# Altium schematic sheet CPU - DDR3.SchDoc: DDR3 SDRAM
size Tabloid; Revision: A; ProjectTitle: CDU: CAN Display Unit
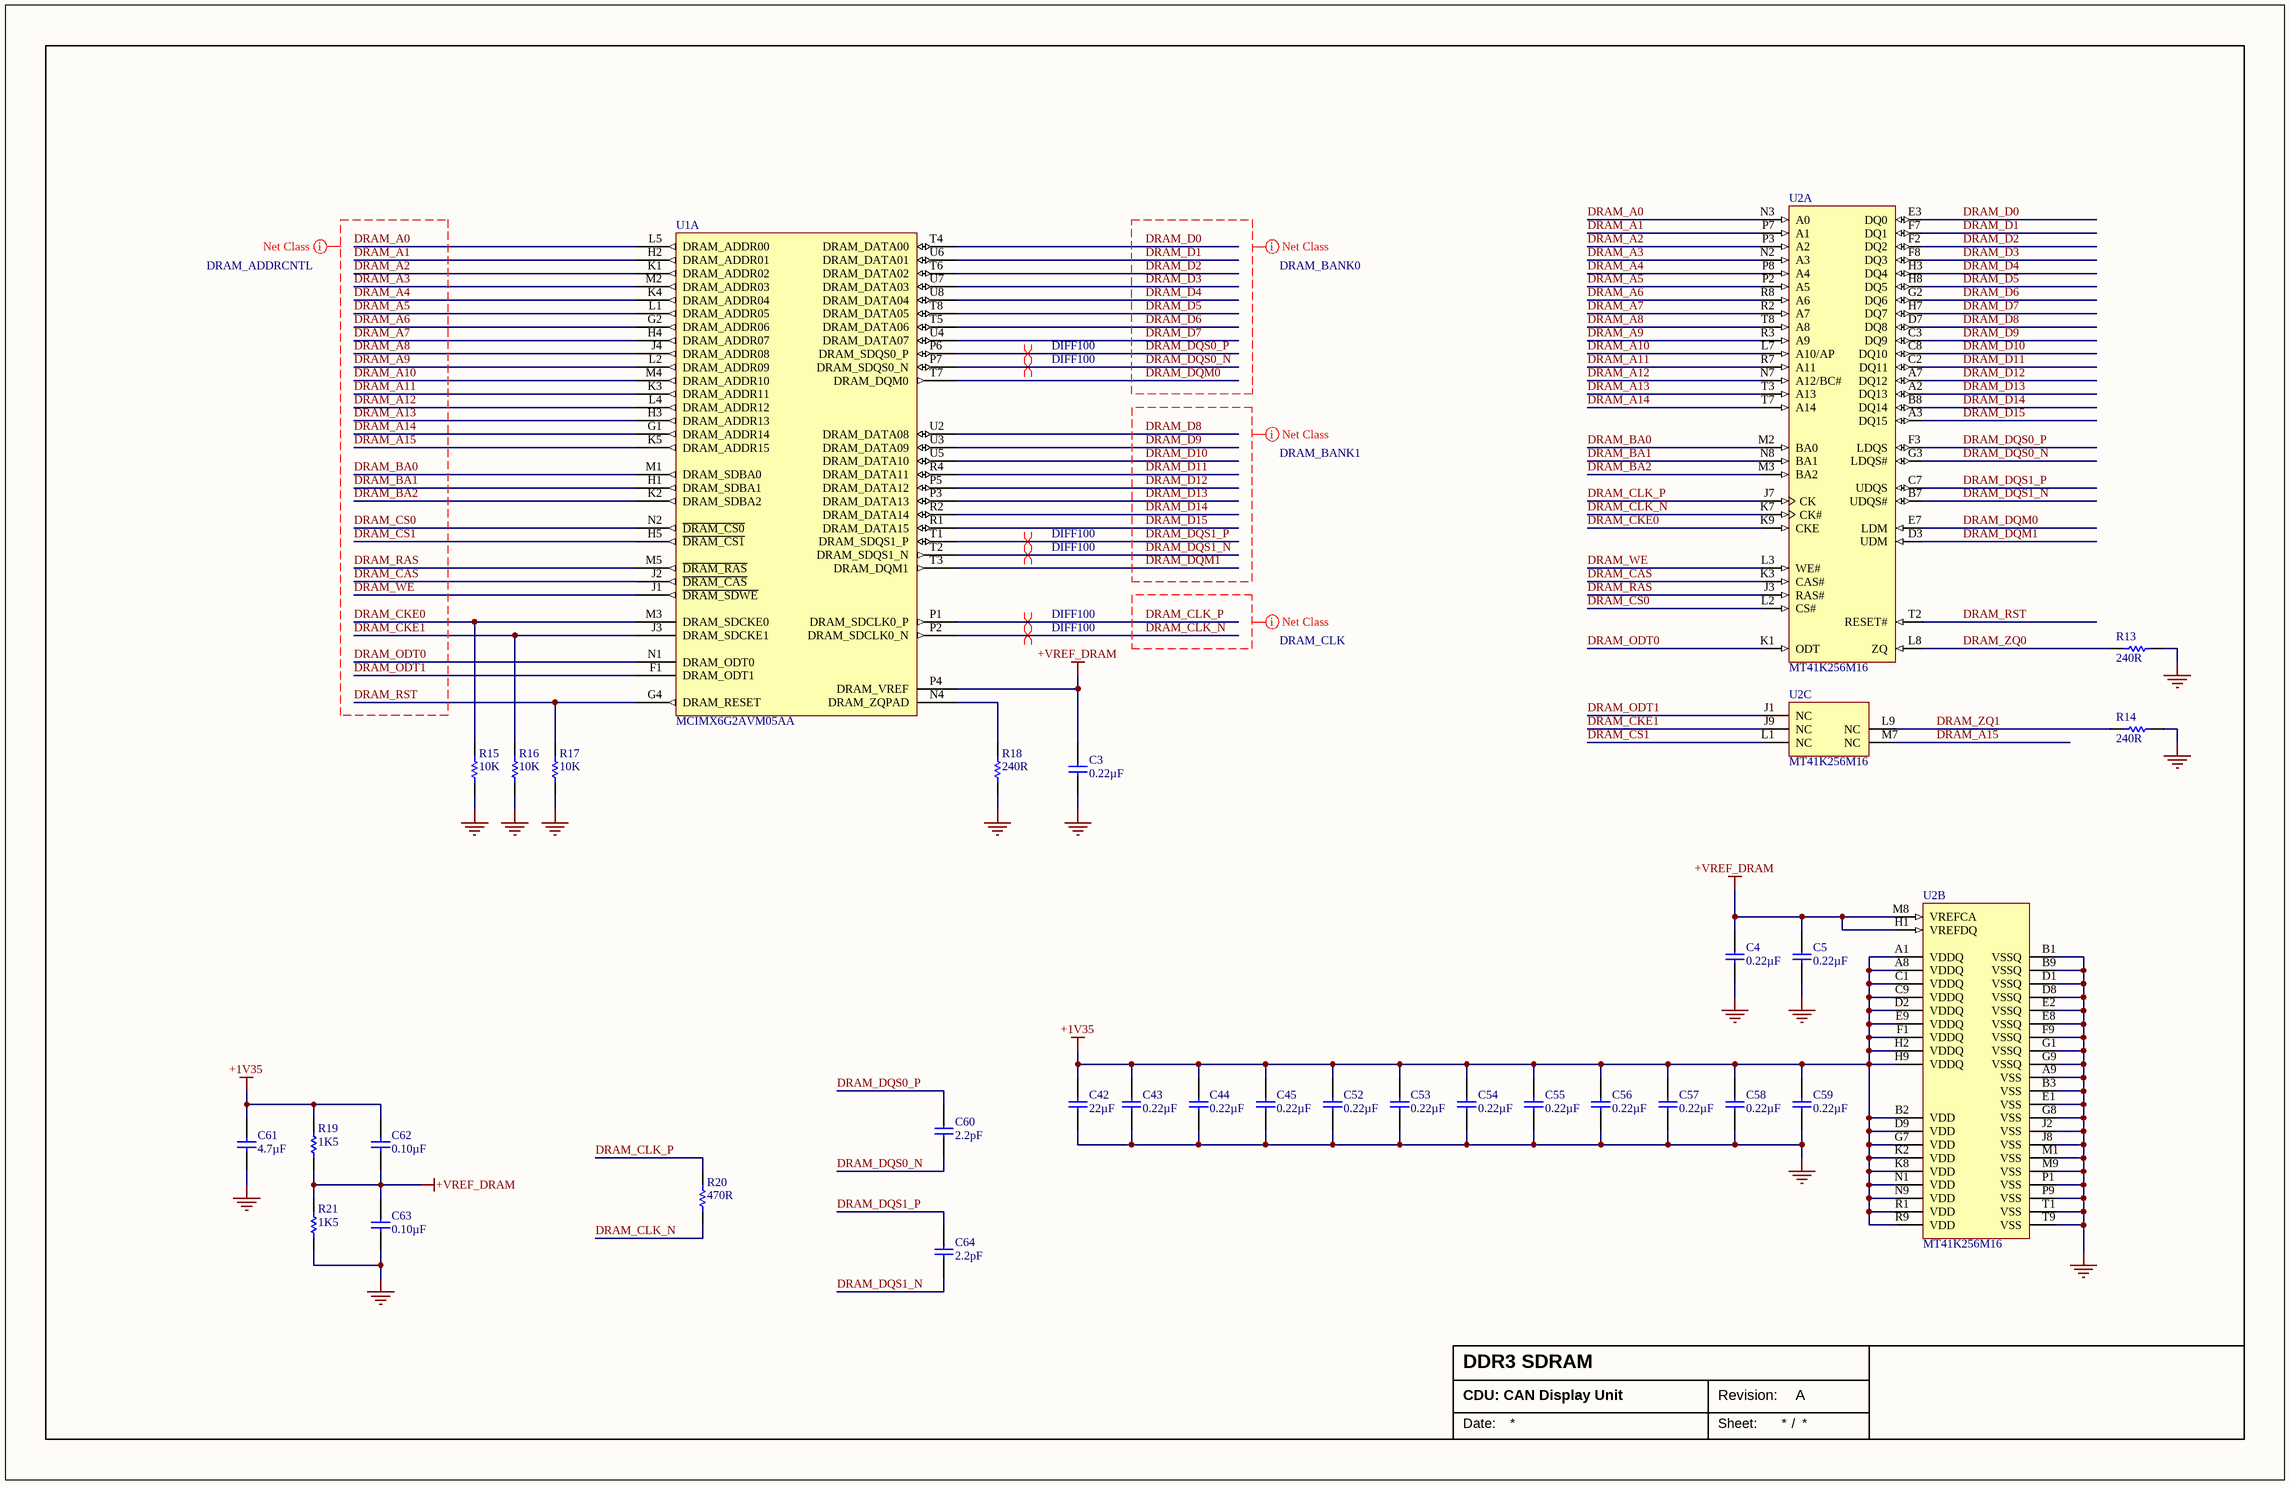
[diagram p0: CPU - DDR3.SchDoc]

## Parts
C3  value 0.22µF  [CAP-0402-M]  (hidden comment: CAP 0.22µF ±10% 16V 0402 X7R)
C4  value 0.22µF  [CAP-0402-M]  (hidden comment: CAP 0.22µF ±10% 16V 0402 X7R)
C5  value 0.22µF  [CAP-0402-M]  (hidden comment: CAP 0.22µF ±10% 16V 0402 X7R)
C42  value 22µF  [CAP-0603-M]  (hidden comment: CAP 22µF ±20% 10V 0603 X5R)
C43  value 0.22µF  [CAP-0402-M]  (hidden comment: CAP 0.22µF ±10% 16V 0402 X7R)
C44  value 0.22µF  [CAP-0402-M]  (hidden comment: CAP 0.22µF ±10% 16V 0402 X7R)
C45  value 0.22µF  [CAP-0402-M]  (hidden comment: CAP 0.22µF ±10% 16V 0402 X7R)
C52  value 0.22µF  [CAP-0402-M]  (hidden comment: CAP 0.22µF ±10% 16V 0402 X7R)
C53  value 0.22µF  [CAP-0402-M]  (hidden comment: CAP 0.22µF ±10% 16V 0402 X7R)
C54  value 0.22µF  [CAP-0402-M]  (hidden comment: CAP 0.22µF ±10% 16V 0402 X7R)
C55  value 0.22µF  [CAP-0402-M]  (hidden comment: CAP 0.22µF ±10% 16V 0402 X7R)
C56  value 0.22µF  [CAP-0402-M]  (hidden comment: CAP 0.22µF ±10% 16V 0402 X7R)
C57  value 0.22µF  [CAP-0402-M]  (hidden comment: CAP 0.22µF ±10% 16V 0402 X7R)
C58  value 0.22µF  [CAP-0402-M]  (hidden comment: CAP 0.22µF ±10% 16V 0402 X7R)
C59  value 0.22µF  [CAP-0402-M]  (hidden comment: CAP 0.22µF ±10% 16V 0402 X7R)
C60  value 2.2pF  [CAP-0402-M]  (hidden comment: CAP 2.2pF ±0.1pF 50V 0402 C0G, NP0)
C61  value 4.7µF  [CAP-0603-M]  (hidden comment: CAP 4.7µF ±10% 10V 0603 X5R)
C62  value 0.10µF  [CAP-0402-M]  (hidden comment: Capacitor)
C63  value 0.10µF  [CAP-0402-M]  (hidden comment: Capacitor)
C64  value 2.2pF  [CAP-0402-M]  (hidden comment: CAP 2.2pF ±0.1pF 50V 0402 C0G, NP0)
R13  value 240R  [RES-0402-M]  (hidden comment: RES 240R 1% 1/16W 0402)
R14  value 240R  [RES-0402-M]  (hidden comment: RES 240R 1% 1/16W 0402)
R15  value 10K  [RES-0603-M]  (hidden comment: RES 10K 1% 1/10 W 0603 ±100ppm/°C)
R16  value 10K  [RES-0603-M]  (hidden comment: RES 10K 1% 1/10 W 0603 ±100ppm/°C)
R17  value 10K  [RES-0603-M]  (hidden comment: RES 10K 1% 1/10 W 0603 ±100ppm/°C)
R18  value 240R  [RES-0402-M]  (hidden comment: RES 240R 1% 1/16W 0402)
R19  value 1K5  [RES-0603-M]  (hidden comment: RES 1K5 1% 1/10 W 0603 ±100ppm/°C)
R20  value 470R  [RES-0402-M]  (hidden comment: RES 470R 1% 1/16W 0402)
R21  value 1K5  [RES-0603-M]  (hidden comment: RES 1K5 1% 1/10 W 0603 ±100ppm/°C)
U1  MCIMX6G2AVM05AA  [BGA289C80P17X17_1400X1400X132]  (part A of 14)
U2  MT41K256M16  [MICT-HA-96]  (parts A,B,C of 3)

## Nets
+1V35: C42.2 C43.1 C44.1 C45.1 C52.1 C53.1 C54.1 C55.1 C56.1 C57.1 C58.1 C59.1 C61.2 C62.2 R19.2 U2.A1(VDDQ) U2.A8(VDDQ) U2.B2(VDD) U2.C1(VDDQ) U2.C9(VDDQ) U2.D2(VDDQ) U2.D9(VDD) U2.E9(VDDQ) U2.F1(VDDQ) U2.G7(VDD) U2.H2(VDDQ) U2.H9(VDDQ) U2.K2(VDD) U2.K8(VDD) U2.N1(VDD) U2.N9(VDD) U2.R1(VDD) U2.R9(VDD)
+VREF_DRAM: C3.1 C4.1 C5.1 C62.1 C63.2 R19.1 R21.2 U1.P4(DRAM_VREF) U2.H1(VREFDQ) U2.M8(VREFCA)
GND: C3.2 C4.2 C5.2 C42.1 C43.2 C44.2 C45.2 C52.2 C53.2 C54.2 C55.2 C56.2 C57.2 C58.2 C59.2 C61.1 C63.1 R13.1 R14.1 R15.1 R16.1 R17.1 R18.1 R21.1 U2.A9(VSS) U2.B1(VSSQ) U2.B3(VSS) U2.B9(VSSQ) U2.D1(VSSQ) U2.D8(VSSQ) U2.E1(VSS) U2.E2(VSSQ) U2.E8(VSSQ) U2.F9(VSSQ) U2.G1(VSSQ) U2.G8(VSS) U2.G9(VSSQ) U2.J2(VSS) U2.J8(VSS) U2.M1(VSS) U2.M9(VSS) U2.P1(VSS) U2.P9(VSS) U2.T1(VSS) U2.T9(VSS)
DRAM_A0: U1.L5(DRAM_ADDR00) U2.N3(A0)
DRAM_A1: U1.H2(DRAM_ADDR01) U2.P7(A1)
DRAM_A2: U1.K1(DRAM_ADDR02) U2.P3(A2)
DRAM_A3: U1.M2(DRAM_ADDR03) U2.N2(A3)
DRAM_A4: U1.K4(DRAM_ADDR04) U2.P8(A4)
DRAM_A5: U1.L1(DRAM_ADDR05) U2.P2(A5)
DRAM_A6: U1.G2(DRAM_ADDR06) U2.R8(A6)
DRAM_A7: U1.H4(DRAM_ADDR07) U2.R2(A7)
DRAM_A8: U1.J4(DRAM_ADDR08) U2.T8(A8)
DRAM_A9: U1.L2(DRAM_ADDR09) U2.R3(A9)
DRAM_A10: U1.M4(DRAM_ADDR10) U2.L7(A10/AP)
DRAM_A11: U1.K3(DRAM_ADDR11) U2.R7(A11)
DRAM_A12: U1.L4(DRAM_ADDR12) U2.N7(A12/BC#)
DRAM_A13: U1.H3(DRAM_ADDR13) U2.T3(A13)
DRAM_A14: U1.G1(DRAM_ADDR14) U2.T7(A14)
DRAM_A15: U1.K5(DRAM_ADDR15) U2.M7(NC)
DRAM_BA0: U1.M1(DRAM_SDBA0) U2.M2(BA0)
DRAM_BA1: U1.H1(DRAM_SDBA1) U2.N8(BA1)
DRAM_BA2: U1.K2(DRAM_SDBA2) U2.M3(BA2)
DRAM_CAS: U1.J2(~{DRAM_CAS}) U2.K3(CAS#)
DRAM_CKE0: R15.2 U1.M3(DRAM_SDCKE0) U2.K9(CKE)
DRAM_CKE1: R16.2 U1.J3(DRAM_SDCKE1) U2.J9(NC)
DRAM_CLK_N: R20.1 U1.P2(DRAM_SDCLK0_N) U2.K7(CK#)
DRAM_CLK_P: R20.2 U1.P1(DRAM_SDCLK0_P) U2.J7(CK)
DRAM_CS0: U1.N2(~{DRAM_CS0}) U2.L2(CS#)
DRAM_CS1: U1.H5(~{DRAM_CS1}) U2.L1(NC)
DRAM_D0: U1.T4(DRAM_DATA00) U2.E3(DQ0)
DRAM_D1: U1.U6(DRAM_DATA01) U2.F7(DQ1)
DRAM_D2: U1.T6(DRAM_DATA02) U2.F2(DQ2)
DRAM_D3: U1.U7(DRAM_DATA03) U2.F8(DQ3)
DRAM_D4: U1.U8(DRAM_DATA04) U2.H3(DQ4)
DRAM_D5: U1.T8(DRAM_DATA05) U2.H8(DQ5)
DRAM_D6: U1.T5(DRAM_DATA06) U2.G2(DQ6)
DRAM_D7: U1.U4(DRAM_DATA07) U2.H7(DQ7)
DRAM_D8: U1.U2(DRAM_DATA08) U2.D7(DQ8)
DRAM_D9: U1.U3(DRAM_DATA09) U2.C3(DQ9)
DRAM_D10: U1.U5(DRAM_DATA10) U2.C8(DQ10)
DRAM_D11: U1.R4(DRAM_DATA11) U2.C2(DQ11)
DRAM_D12: U1.P5(DRAM_DATA12) U2.A7(DQ12)
DRAM_D13: U1.P3(DRAM_DATA13) U2.A2(DQ13)
DRAM_D14: U1.R2(DRAM_DATA14) U2.B8(DQ14)
DRAM_D15: U1.R1(DRAM_DATA15) U2.A3(DQ15)
DRAM_DQM0: U1.T7(DRAM_DQM0) U2.E7(LDM)
DRAM_DQM1: U1.T3(DRAM_DQM1) U2.D3(UDM)
DRAM_DQS0_N: C60.2 U1.P7(DRAM_SDQS0_N) U2.G3(LDQS#)
DRAM_DQS0_P: C60.1 U1.P6(DRAM_SDQS0_P) U2.F3(LDQS)
DRAM_DQS1_N: C64.2 U1.T2(DRAM_SDQS1_N) U2.B7(UDQS#)
DRAM_DQS1_P: C64.1 U1.T1(DRAM_SDQS1_P) U2.C7(UDQS)
DRAM_ODT0: U1.N1(DRAM_ODT0) U2.K1(ODT)
DRAM_ODT1: U1.F1(DRAM_ODT1) U2.J1(NC)
DRAM_RAS: U1.M5(~{DRAM_RAS}) U2.J3(RAS#)
DRAM_RST: R17.2 U1.G4(DRAM_RESET) U2.T2(RESET#)
DRAM_WE: U1.J1(~{DRAM_SDWE}) U2.L3(WE#)
DRAM_ZQ0: R13.2 U2.L8(ZQ)
DRAM_ZQ1: R14.2 U2.L9(NC)
NetR18_2: R18.2 U1.N4(DRAM_ZQPAD)

## Layout directives
net class DRAM_BANK0: DRAM_D0, DRAM_D1, DRAM_D2, DRAM_D3, DRAM_D4, DRAM_D5, DRAM_D6, DRAM_D7, DRAM_DQM0, DRAM_DQS0_N, DRAM_DQS0_P
net class DRAM_BANK1: DRAM_D8, DRAM_D9, DRAM_D10, DRAM_D11, DRAM_D12, DRAM_D13, DRAM_D14, DRAM_D15, DRAM_DQM1, DRAM_DQS1_N, DRAM_DQS1_P
net class DRAM_ADDRCNTL: DRAM_A0, DRAM_A1, DRAM_A2, DRAM_A3, DRAM_A4, DRAM_A5, DRAM_A6, DRAM_A7, DRAM_A8, DRAM_A9, DRAM_A10, DRAM_A11, DRAM_A12, DRAM_A13, DRAM_A14, DRAM_A15, DRAM_BA0, DRAM_BA1, DRAM_BA2, DRAM_CAS, DRAM_CKE0, DRAM_CKE1, DRAM_CS0, DRAM_CS1, DRAM_ODT0, DRAM_ODT1, DRAM_RAS, DRAM_RST, DRAM_WE
differential pair; net class DIFF100: DRAM_CLK_N, DRAM_CLK_P, DRAM_DQS0_N, DRAM_DQS0_P, DRAM_DQS1_N, DRAM_DQS1_P
net class DRAM_CLK: DRAM_CLK_N, DRAM_CLK_P

## Notes on the sheet
- Date:
- Revision:
- Sheet:
- /

## Library data of the parts
C3-C5 C43-C45 C52-C59 = CC0402KRX7R7BB224: Manufacturer: Yageo; Manufacturer Series: CC; Part Number: CC0402KRX7R7BB224; Component Type: Standard; Tolerance: ±10%; Voltage: 16V; Package: 0402; Temperature Coefficient: X7R; Temperature Range: -55°C ~ 125°C; Supplier 1: Digi-Key; Supplier Part Number 1: 311-1708-1-ND
C42 = CC0603MRX5R6BB226: Manufacturer: Yageo; Manufacturer Series: CC; Part Number: CC0603MRX5R6BB226; Component Type: Standard; Tolerance: ±20%; Voltage: 10V; Package: 0603; Temperature Coefficient: X5R; Temperature Range: -55°C ~ 85°C; Supplier 1: Digi-Key; Supplier Part Number 1: 311-1819-1-ND
C60 C64 = CC0402BRNPO9BN2R2: Manufacturer: Yageo; Manufacturer Series: CC; Part Number: CC0402BRNPO9BN2R2; Component Type: Standard; Tolerance: ±0.1pF; Voltage: 50V; Package: 0402; Temperature Coefficient: C0G, NP0; Temperature Range: -55°C ~ 125°C; Supplier 1: Digi-Key; Supplier Part Number 1: 311-1618-1-ND
C61 = CC0603KRX5R6BB475: Manufacturer: Yageo; Manufacturer Series: CC; Part Number: CC0603KRX5R6BB475; Component Type: Standard; Tolerance: ±10%; Voltage: 10V; Package: 0603; Temperature Coefficient: X5R; Temperature Range: -55°C ~ 85°C; Supplier 1: Digi-Key; Supplier Part Number 1: 311-1455-1-ND
C62 C63 = CC0402KRX7R8BB104: Manufacturer: Yageo; Manufacturer Series: CC; Tolerance: ±10%; Voltage: 25V; Temperature Coefficient: X7R; Part Number: CC0402KRX7R8BB104; Component Type: Standard; Package: 0402; Temperature Range: -55°C ~ 125°C; Supplier 1: Digi-Key; Supplier Part Number 1: 311-2077-1-ND
R13 R14 R18 = RC0402FR-07240RL: Manufacturer: Yageo; Manufacturer Series: RC; Part Number: RC0402FR-07240RL; Component Type: Standard; Tolerance: 1%; Power: 1/16W; Package: 0402; Temperature Range: -55°C ~ 155°C; Supplier 1: Digi-Key; Supplier Part Number 1: 311-240LRCT-ND
R15-R17 = RC0603FR-0710KL: Manufacturer: Yageo; Manufacturer Series: RC; Power: 1/10 W; Part Number: RC0603FR-0710KL; Component Type: Standard; Tolerance: 1%; Package: 0603; Temperature Coefficient: ±100ppm/°C; Temperature Range: -55°C ~ 155°C; Supplier 1: Digi-Key; Supplier Part Number 1: 311-10.0KHRCT-ND
R19 R21 = RC0603FR-071K5L: Manufacturer: Yageo; Manufacturer Series: RC; Power: 1/10 W; Part Number: RC0603FR-071K5L; Component Type: Standard; Tolerance: 1%; Package: 0603; Temperature Coefficient: ±100ppm/°C; Temperature Range: -55°C ~ 155°C; Supplier 1: Digi-Key; Supplier Part Number 1: 311-1.50KHRCT-ND
R20 = RC0402FR-07470RL: Manufacturer: Yageo; Manufacturer Series: RC; Part Number: RC0402FR-07470RL; Component Type: Standard; Tolerance: 1%; Power: 1/16W; Package: 0402; Temperature Range: -55°C ~ 155°C; Supplier 1: Digi-Key; Supplier Part Number 1: 311-470LRCT-ND